# EAGLE design SparkFun_Pi_Wedge_40-Pin_PreAssembled (EAGLE 7.3.0)
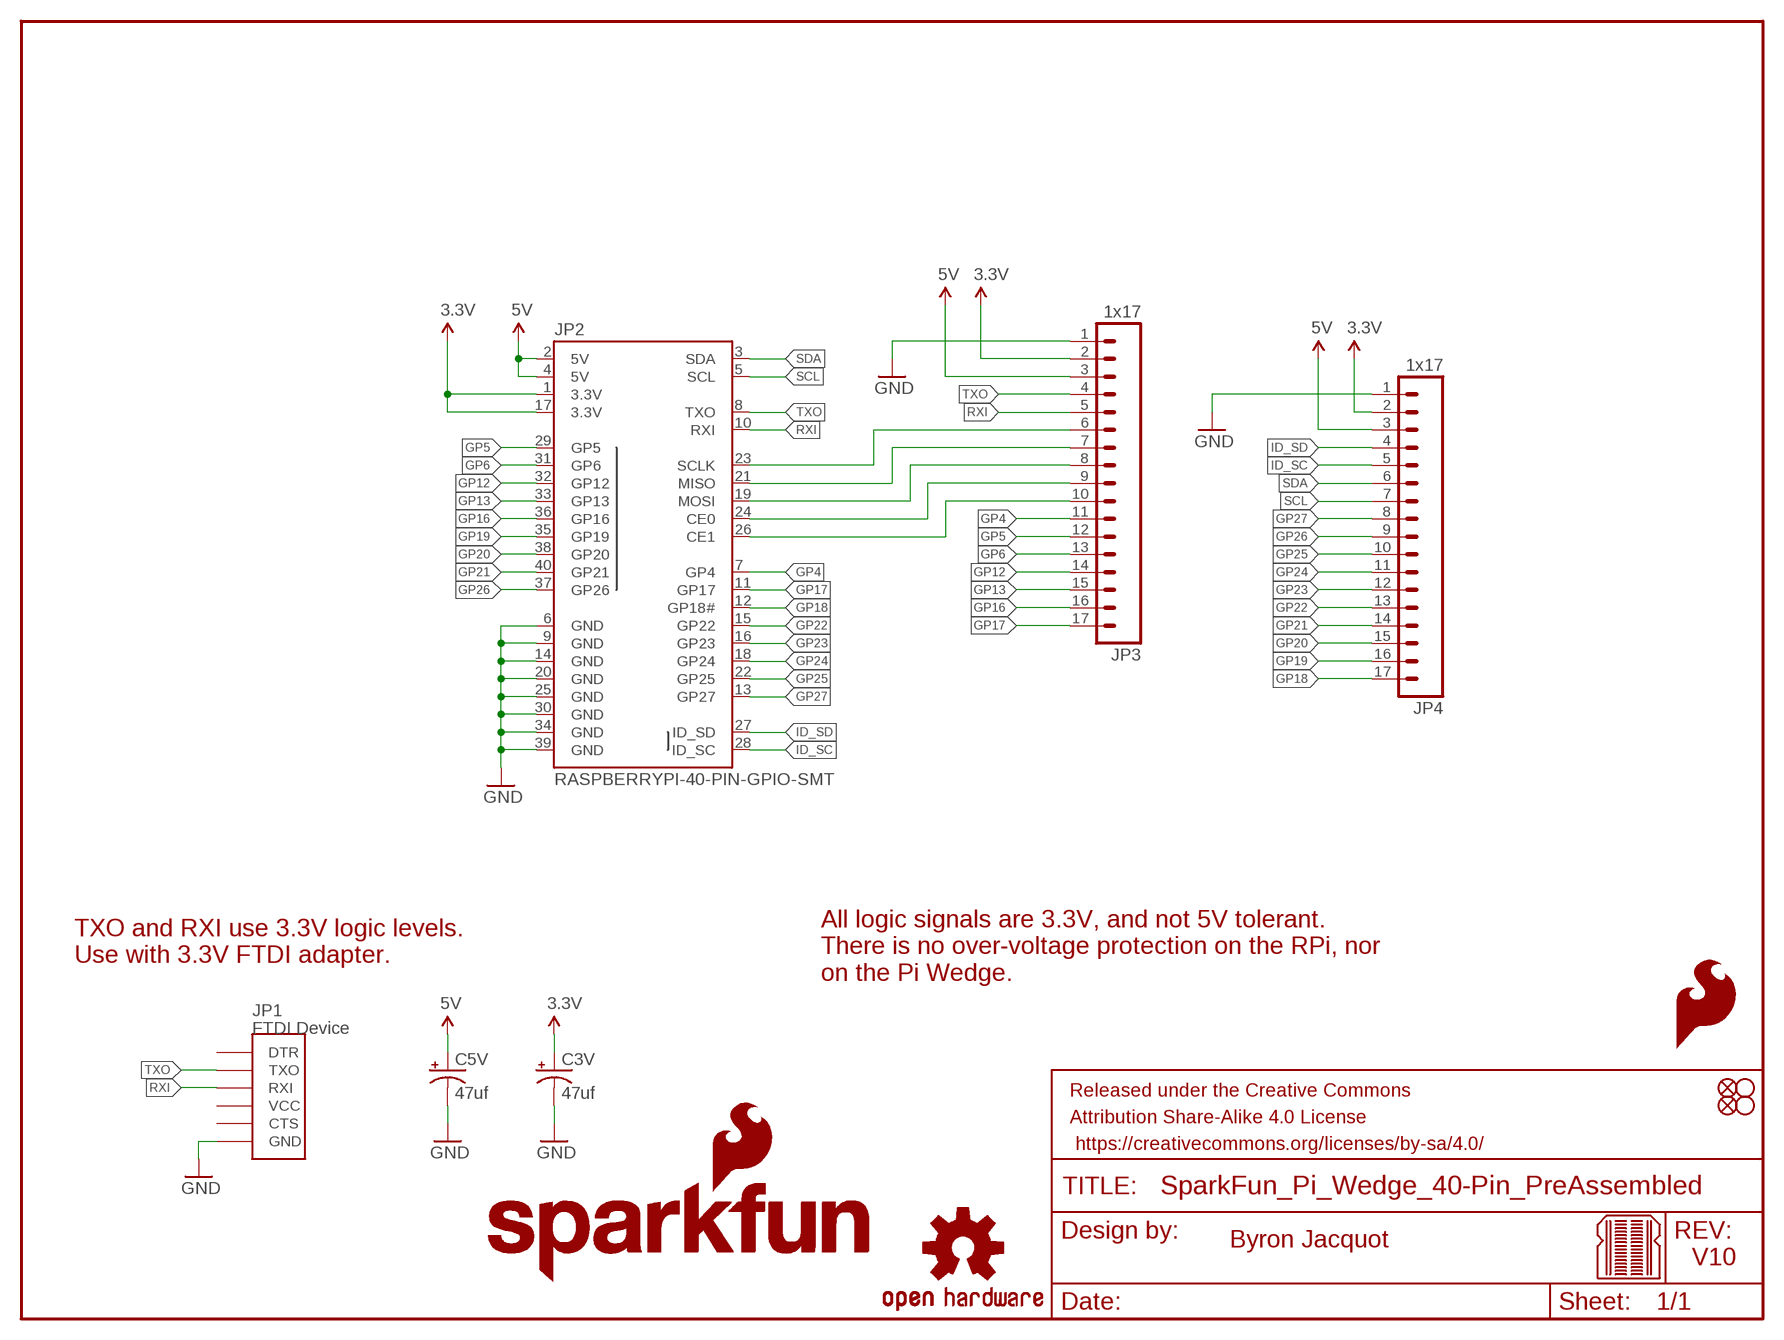
[diagram p0: schematic, sheet 1]

## Parts
C3V  47uf  47UF-50V-20%(ELECT)  [PANASONIC_D]
C5V  47uf  47UF-50V-20%(ELECT)  [PANASONIC_D]
FID1  FIDUCIALUFIDUCIAL  [MICRO-FIDUCIAL]
FID2  FIDUCIALUFIDUCIAL  [MICRO-FIDUCIAL]
FRAME2  FRAME-LETTER  [CREATIVE_COMMONS]
JP1  FTDI Device  FTDI_DEVICERA_SMT  [FTDI_DEVICE_RA_SMT]
JP2  RASPBERRYPI-40-PIN-GPIO-SMT  [2X20-SHROUDED-SMT]
JP3  1x17  M17KIT  [1X17_NO_SILK_KIT]
JP4  1x17  M17KIT  [1X17_NO_SILK_KIT]
LOGO1  SFE_LOGO_NAME.2_INCH  [SFE_LOGO_NAME_.2]
LOGO2  SFE_LOGO_NAME_FLAME.2_INCH  [SFE_LOGO_NAME_FLAME_.2]
LOGO3  SFE_LOGO_FLAME.1_INCH  [SFE_LOGO_FLAME_.1]
LOGO4  SFE_LOGO_FLAME.1_INCH  [SFE_LOGO_FLAME_.1]
LOGO5  OSHW-LOGOS  [OSHW-LOGO-S]
STANDOFF1  STAND-OFF  [STAND-OFF]
STANDOFF2  STAND-OFF  [STAND-OFF]
U$2  BREADBOARD_PATTERN  [BREADBOARD_SPACING]

## Nets
3.3V: C3V.+ JP2.1(3.3V) JP2.17(3.3V) JP3.2 JP4.2
5V: C5V.+ JP2.2(5V) JP2.4(5V) JP3.3 JP4.3
CE0: JP2.24(CE0) JP3.9
CE1: JP2.26(CE1) JP3.10
GND: C3V.- C5V.- JP1.6(GND) JP2.6(GND) JP2.9(GND) JP2.14(GND) JP2.20(GND) JP2.25(GND) JP2.30(GND) JP2.34(GND) JP2.39(GND) JP3.1 JP4.1
GP4: JP2.7(GP4) JP3.11
GP5: JP2.29(GP5) JP3.12
GP6: JP2.31(GP6) JP3.13
GP12: JP2.32(GP12) JP3.14
GP13: JP2.33(GP13) JP3.15
GP16: JP2.36(GP16) JP3.16
GP17: JP2.11(GP17) JP3.17
GP18: JP2.12(GP18#) JP4.17
GP19: JP2.35(GP19) JP4.16
GP20: JP2.38(GP20) JP4.15
GP21: JP2.40(GP21) JP4.14
GP22: JP2.15(GP22) JP4.13
GP23: JP2.16(GP23) JP4.12
GP24: JP2.18(GP24) JP4.11
GP25: JP2.22(GP25) JP4.10
GP26: JP2.37(GP26) JP4.9
GP27: JP2.13(GP27) JP4.8
ID_SC: JP2.28(ID_SC) JP4.5
ID_SD: JP2.27(ID_SD) JP4.4
MISO: JP2.21(MISO) JP3.7
MOSI: JP2.19(MOSI) JP3.8
RXI: JP1.3(RXI) JP2.10(RXI) JP3.5
SCL: JP2.5(SCL) JP4.7
SCLK: JP2.23(SCLK) JP3.6
SDA: JP2.3(SDA) JP4.6
TXO: JP1.2(TXO) JP2.8(TXO) JP3.4
Unconnected: JP1.1(DTR) JP1.4(VCC) JP1.5(CTS)

## Notes on the sheet
- TXO and RXI use 3.3V logic levels.
  Use with 3.3V FTDI adapter.
- All logic signals are 3.3V, and not 5V tolerant.
  There is no over-voltage protection on the RPi, nor
  on the Pi Wedge.
- Byron Jacquot
- V10

## Library data of the parts
C3V C5V = SparkFun-Capacitors:47UF-50V-20%(ELECT): CAP-10547; PROD_ID: CAP-10547
FID1 FID2 = SparkFun-Aesthetics:FIDUCIAL: Fiducial Alignment Points Various fiducial points for machine vision alignment.
FRAME2 = SparkFun-Aesthetics:FRAME-LETTER: Schematic Frame Standard 8.5x11 US Letter frame
JP1 = SparkFun-Connectors:FTDI_DEVICE: Connector which mates to FTDI basic or FTDI cable.; PROD_ID: CONN-08971
JP2 = SparkFun-Boards:RASPBERRYPI-40-PIN-GPIO: Second Generation Raspberry Pi GPIO Header 2x20 pin connector, as found on B, B+, A+ models.; PROD_ID: CONN-13143
JP3 JP4 = SparkFun-Connectors:M17: 1x17 .1" header; PROD_ID: CONN-12294
LOGO1 = SparkFun-Aesthetics:SFE_LOGO_NAME: SFE Logo, name only This is the SparkFun name logo. The logo on the schematic will always be the same size; the package variant is the height of the flame part of the logo (or the height the flame would be, if it were drawn). Default layer for the logo on the board is tSilk.
LOGO2 = SparkFun-Aesthetics:SFE_LOGO_NAME_FLAME: SFE Logo, name and flame This is the SparkFun full logo. The logo on the schematic will always be the same size; the package variant is the height of the flame part of the logo. Default layer for the logo on the board is tSilk.
LOGO3 LOGO4 = SparkFun-Aesthetics:SFE_LOGO_FLAME: SFE Logo, flame only This is the SparkFun flame logo. The logo on the schematic will always be the same size; the package variant is the height of the flame. Default layer for the logo on the board is tSilk.
LOGO5 = SparkFun-Aesthetics:OSHW-LOGO: Open Source Hardware Logo This logo indicates the piece of hardware it is found on incorporates a OSHW license and/or adheres to the definition of open source hardware found here: http://freedomdefined.org/OSHW
STANDOFF1 STANDOFF2 = SparkFun-Electromechanical:STAND-OFF: #4 Stand Off This is the mechanical footprint for a #4 phillips button head screw. Use the keepout ring to avoid running the screw head into surrounding components. SKU : PRT-00447
U$2 = SparkFun-Aesthetics:BREADBOARD_PATTERN: Reference markings that correspond to solderless breadboard row spacing.

## Board
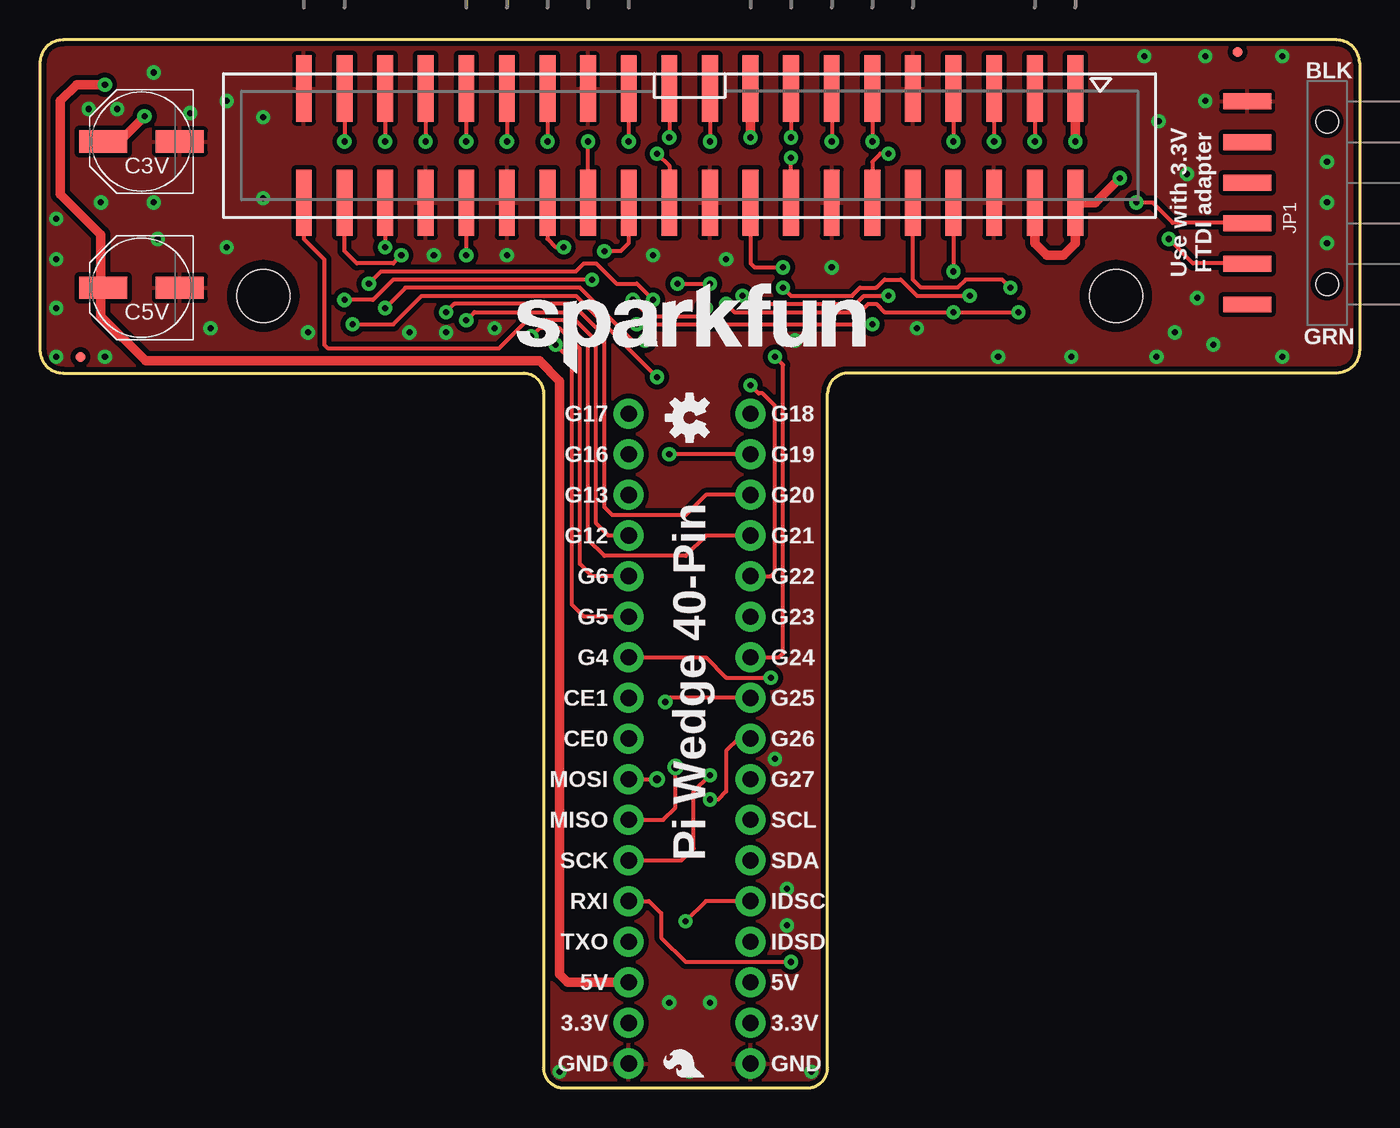
[diagram p1: board, top side]
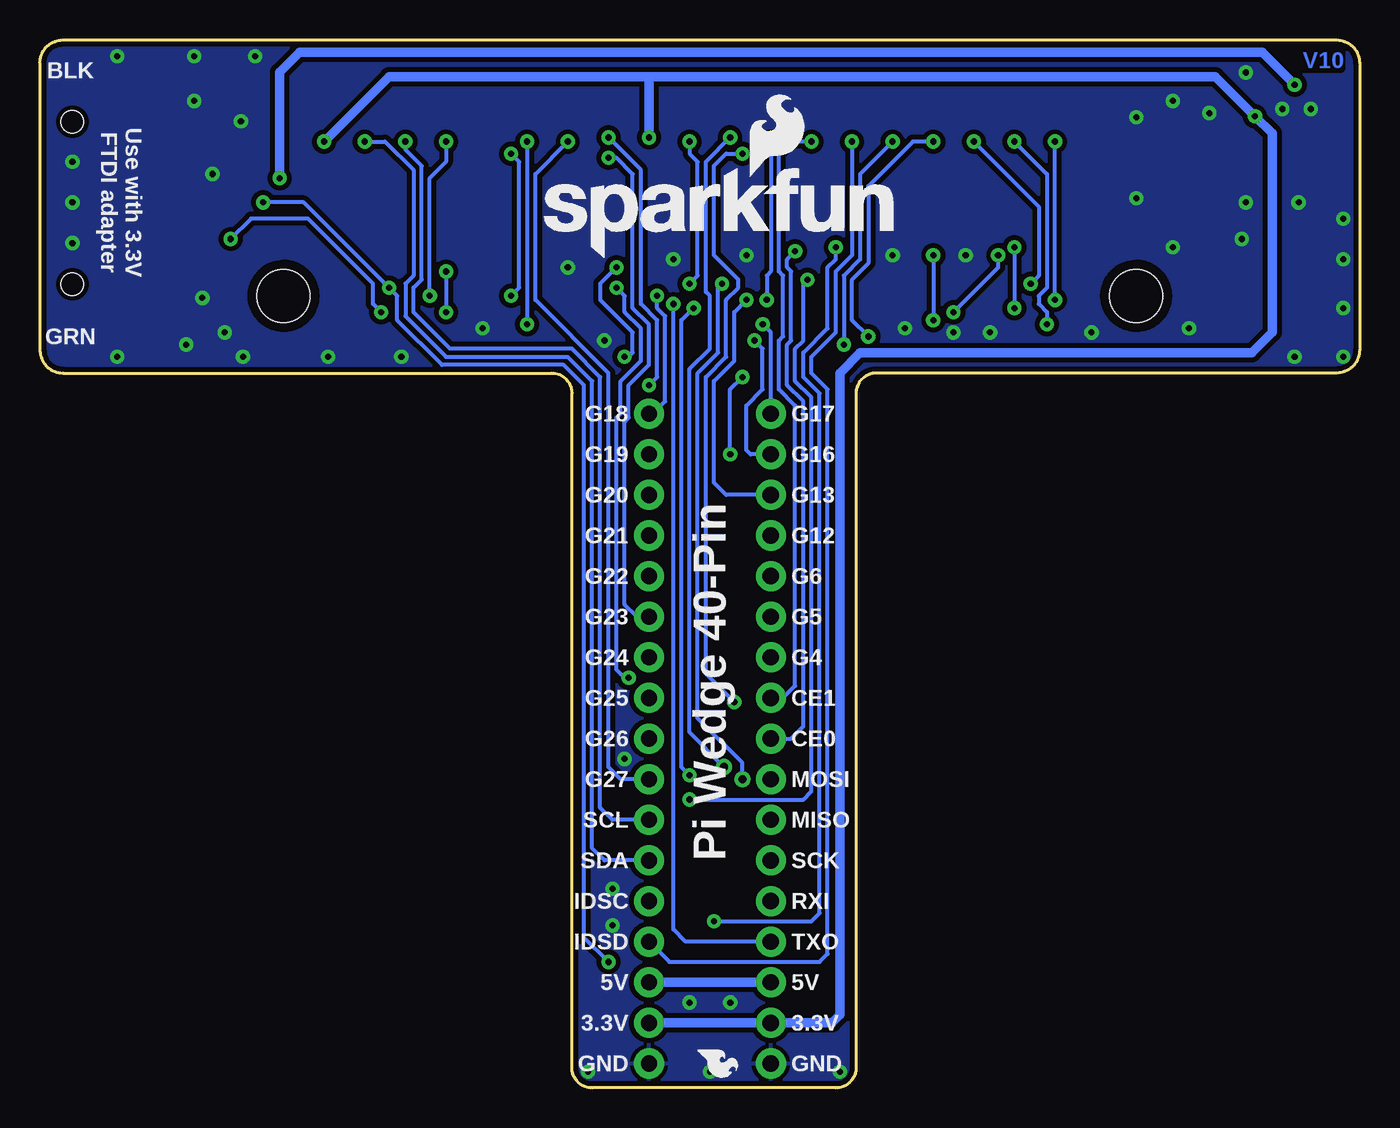
[diagram p2: board, bottom side, seen from below]

Size 82.55 x 65.53 mm. Coordinates in mm from the lower left corner, seen from the top.
Outline: 82.55,64.09 82.55,46.14 arc-90 81.11,44.7 50.55,44.7 arc90 49.28,43.43 49.28,1.27 arc-90 48.01,0 32.77,0 arc-90 31.5,1.27 31.5,43.43 arc90 30.23,44.7 1.44,44.7 arc-90 0,46.14 0,64.09 arc-90 1.44,65.53 81.11,65.53 arc-90 82.55,64.09
Copper layers (1*16): Top 0.035mm / dielectric 1.5mm / Bottom 0.035mm
Design rules "SparkFun-2-layer": minimum track width 7mil, minimum drill 15mil, track to track 8mil, track to pad 8mil, pad to pad 8mil, via to via 8mil, smd to smd 8mil, copper to edge 8mil, drill to drill 8mil, minimum pad ring 12mil, minimum via ring 10mil, stop-mask expansion 4mil, vias tented up to drill 20mil, thermal gap 10mil

### Footprints (pad centres in the part's own frame; a part is rotated, then mirrored left to right if it is on the bottom)
PANASONIC_D = smd 3 x 1.4: + 2.4,0; - -2.4,0
MICRO-FIDUCIAL = smd 0.635 x 0.635: 1 0,0
FTDI_DEVICE_RA_SMT = smd 1 x 3: 1 -6.35,5; 2 -3.81,5; 3 -1.27,5; 4 1.27,5; 5 3.81,5; 6 6.35,5 | hole 1.4: -5.08,0; 5.08,0
2X20-SHROUDED-SMT = smd 4.14 x 0.991: 1 -3.569,24.13; 2 3.569,24.13; 3 -3.569,21.59; 4 3.569,21.59; 5 -3.569,19.05; 6 3.569,19.05; 7 -3.569,16.51; 8 3.569,16.51; 9 -3.569,13.97; 10 3.569,13.97; 11 -3.569,11.43; 12 3.569,11.43; 13 -3.569,8.89; 14 3.569,8.89; 15 -3.569,6.35; 16 3.569,6.35; 17 -3.569,3.81; 18 3.569,3.81; 19 -3.569,1.27; 20 3.569,1.27; 21 -3.569,-1.27; 22 3.569,-1.27; 23 -3.569,-3.81; 24 3.569,-3.81; 25 -3.569,-6.35; 26 3.569,-6.35; 27 -3.569,-8.89; 28 3.569,-8.89; 29 -3.569,-11.43; 30 3.569,-11.43; 31 -3.569,-13.97; 32 3.569,-13.97; 33 -3.569,-16.51; 34 3.569,-16.51; 35 -3.569,-19.05; 36 3.569,-19.05; 37 -3.569,-21.59; 38 3.569,-21.59; 39 -3.569,-24.13; 40 3.569,-24.13
1X17_NO_SILK_KIT = drill 1.016 pad 1.88: 1 0,0; 2 2.54,0; 3 5.08,0; 4 7.62,0; 5 10.16,0; 6 12.7,0; 7 15.24,0; 8 17.78,0; 9 20.32,0; 10 22.86,0; 11 25.4,0; 12 27.94,0; 13 30.48,0; 14 33.02,0; 15 35.56,0; 16 38.1,0; 17 40.64,0
STAND-OFF = hole 3.302: 0,0

### Placement (x,y rotation side)
C3V  6.35,59.18 180 top
C5V  6.35,50.04 180 top
FID1  74.93,64.77 0 top
FID2  2.54,45.72 0 top
FRAME2  19.56,-17.78 0 top  (outside the outline)
JP1  80.52,55.34 90 top
JP2  40.64,58.93 270 top
JP3  36.83,1.52 90 bottom
JP4  44.45,1.52 90 bottom
LOGO1  29.84,44.7 0 top
LOGO2  51.69,51.82 0 bottom
LOGO3  41.91,0.38 90 top
LOGO4  41.78,2.67 270 bottom
LOGO5  40.64,41.91 90 top
STANDOFF1  13.97,49.53 0 top
STANDOFF2  67.31,49.53 0 top
U$2  40.64,68.83 0 top  (outside the outline)

### Tracks (layer width: path | path; a pad name or v marks a point on that pad's centre or on a via)
3.3V  (via drill 0.38)
  Top 0.61: v64.77,59.18 JP2.1 | JP2.17 v44.45,59.44 | C3V.+ 4.95,59.18 v6.54,60.77 6.48,60.71
  Bottom 0.61: JP4.2 JP3.2 33.02,4.06 32.51,4.57 32.51,44.7 31.24,45.97 6.73,45.97 5.46,47.24 5.46,59.69 v6.54,60.77 9.02,63.25 44.45,63.25 | 44.45,63.25 60.71,63.25 v64.77,59.18 | v44.45,59.44 44.45,63.25
5V  (via drill 0.38)
  Top 0.254: 4.2,49.92 3.81,49.53
  Top 0.61: JP3.3 33.02,6.6 32.51,7.11 32.51,44.2 31.24,45.47 6.6,45.47 3.81,48.26 3.81,49.53 3.81,50.04 | 3.81,50.04 3.81,53.34 1.27,55.88 1.27,61.72 2.29,62.74 v4.06,62.74 | 3.81,50.04 C5V.+ | JP2.4 62.23,52.83 62.99,52.07 64.01,52.07 64.77,52.83 JP2.2 66.03,55.36 v67.56,56.9
  Bottom 0.61: JP3.3 JP4.3 | v4.06,62.74 6.1,64.77 66.29,64.77 67.56,63.5 v67.56,56.9
CE0  (via drill 0.38)
  Top 0.254: JP2.24 36.83,52.83 36.32,52.32 v35.31,52.32
  Bottom 0.254: JP3.9 35.56,21.84 34.8,22.61 34.8,42.93 35.81,43.94 35.81,46.48 35.56,46.74 35.56,51.05 35.81,51.31 35.81,51.82 v35.31,52.32
CE1  (via drill 0.38)
  Top 0.254: JP2.26 v34.29,59.18
  Bottom 0.254: JP3.10 36.07,24.38 35.31,25.15 35.31,42.67 36.32,43.69 36.32,46.74 36.07,46.99 36.07,50.8 36.32,51.05 36.32,58.42 35.56,59.18 v34.29,59.18
GND  (via drill 0.38)
  other vias: 39.37,5.33 41.91,5.33 72.9,61.72 72.39,49.4 73.41,46.48 64.52,45.72 4.83,61.21 3.05,61.21 7.11,55.37 4.06,45.72 1.02,54.36 9.4,60.96 45.97,20.57 70.99,47.24 7.37,53.09 13.97,60.71 13.97,55.63 23.11,47.24 16.76,47.24 1.02,45.72 1.02,48.77 1.02,51.82 7.11,63.5 3.81,55.37 11.68,61.72 11.68,52.58 10.67,47.5 59.94,45.72 69.85,45.72 77.72,45.72 77.72,64.52 72.9,64.52 69.09,64.52 28.45,47.5 25.4,47.24 71.75,57.15 69.98,60.45 46.74,10.16 46.74,12.45 48.26,1.02 32.51,1.02 40.64,1.02 54.86,47.5 49.53,51.31 47.24,46.74 42.93,51.82 38.35,52.07 29.21,52.07 24.64,52.07 80.52,52.83 80.52,55.37 80.52,57.91
  pour Bottom (isolate 0.305): 1.27,44.7 30.23,44.7 arc-90 31.5,43.43 31.5,1.27 arc90 32.77,0 48.01,0 arc90 49.28,1.27 49.28,43.43 arc-90 50.55,44.7 81.28,44.7 arc90 82.55,45.97 82.55,65.53 0,65.53 0,46.1 arc90
  pour Top (isolate 0.305): 49.28,43.43 49.28,1.27 arc-90 48.01,0 32.77,0 arc-90 31.5,1.27 31.5,43.43 arc90 30.23,44.7 1.27,44.7 arc-90 0,46.1 0,65.53 82.55,65.53 82.55,45.97 arc-90 81.28,44.7 50.55,44.7 arc90
GP4  (via drill 0.38)
  Top 0.254: JP3.11 41.66,26.92 42.93,25.65 v45.72,25.65 | v46.48,50.04 46.99,49.53 50.8,49.53 51.31,50.04 52.32,50.04 52.83,50.55 53.85,50.55 54.86,49.53 v58.17,49.53 | JP2.7 v57.15,59.18
  Bottom 0.254: v45.72,25.65 45.97,25.65 46.48,26.16 46.48,41.91 46.23,42.16 46.23,44.2 44.96,45.47 44.96,47.5 45.97,48.51 45.97,49.53 v46.48,50.04 | v58.17,49.53 58.17,56.9 57.15,57.91 v57.15,59.18
GP5  (via drill 0.38)
  Top 0.254: JP3.12 34.04,29.46 33.27,30.23 33.27,45.47 v32.26,46.48 | JP2.29 v29.21,59.18
  Bottom 0.254: v29.21,59.18 31.24,57.15 31.24,51.82 32.26,50.8 v32.26,46.48
GP6  (via drill 0.38)
  Top 0.254: JP3.13 34.54,32 33.78,32.77 33.78,46.23 32.51,47.5 31.24,47.5 v30.73,46.99 | JP2.31 v26.67,59.18
  Bottom 0.254: v26.67,59.18 27.94,59.18 30.73,56.39 30.73,51.56 31.75,50.55 31.75,48.01 v30.73,46.99
GP12  (via drill 0.38)
  Top 0.254: JP3.14 35.56,34.54 34.8,35.31 34.8,46.74 33.02,48.51 27.18,48.51 v26.67,48.01 | JP2.32 v26.67,52.07
  Bottom 0.254: v26.67,52.07 v26.67,48.01
GP13  (via drill 0.38)
  Top 0.254: JP2.33 v24.13,59.18 | v20.57,50.29 21.34,51.05 33.53,51.05 34.04,51.56 34.8,51.56 36.07,50.29 37.34,50.29 v38.35,49.28
  Bottom 0.254: JP3.15 39.62,37.08 40.39,37.85 40.39,44.2 39.12,45.47 39.12,48.51 v38.35,49.28 | v24.13,59.18 20.07,55.12 20.07,50.8 v20.57,50.29
GP16  (via drill 0.38)
  Top 0.254: v37.85,46.74 37.08,46.74 33.78,50.04 22.86,50.04 v21.59,48.77 | JP2.36 v21.59,52.58
  Bottom 0.254: JP3.16 38.1,39.62 38.35,39.88 38.35,42.67 37.34,43.69 37.34,46.23 v37.85,46.74 | v21.59,52.58 v21.59,48.77
GP17  (via drill 0.38)
  Top 0.254: JP2.11 v52.07,59.18 | v37.34,47.75 v52.07,47.75
  Bottom 0.254: JP3.17 36.83,47.24 v37.34,47.75 | v52.07,59.18 v52.07,47.75
GP18  (via drill 0.38)
  Top 0.254: v43.94,49.53 44.45,49.02 51.05,49.02 51.56,49.53 v53.09,49.53 | v53.09,58.42 52.58,58.42 52.07,57.91 JP2.12
  Bottom 0.254: JP4.17 44.2,42.16 43.43,42.93 43.43,48.26 43.94,48.77 v43.94,49.53 | v53.09,49.53 52.58,50.04 52.58,57.91 v53.09,58.42
GP19  (via drill 0.38)
  Top 0.254: JP4.16 v39.37,39.62 | JP2.35 v21.59,59.18 | v19.56,47.75 22.1,47.75 23.88,49.53 33.53,49.53 v38.61,44.45
  Bottom 0.254: v21.59,59.18 19.56,57.15 19.56,50.04 20.07,49.53 20.07,49.02 19.56,48.51 v19.56,47.75 | v38.61,44.45 39.37,43.69 v39.37,39.62
GP20  (via drill 0.38)
  Top 0.254: JP4.15 41.66,37.08 40.39,35.81 35.81,35.81 35.31,36.32 35.31,46.99 33.27,49.02 25.91,49.02 v25.4,48.51 | JP2.38 19.05,52.32 19.81,51.56 22.1,51.56 v22.61,52.07
  Bottom 0.254: v25.4,48.51 22.61,51.31 v22.61,52.07
GP21
  Top 0.254: JP4.14 41.66,34.54 40.39,33.27 35.31,33.27 34.29,34.29 34.29,46.48 32.77,48.01 30.48,48.01 28.7,46.23 18.03,46.23 17.78,46.48 17.78,51.82 16.51,53.09 JP2.40
GP22  (via drill 0.38)
  Top 0.254: JP4.13 45.72,32 45.97,32.26 45.97,42.67 45.21,43.43 44.96,43.43 v44.45,43.94 | JP2.15 v46.99,59.44
  Bottom 0.254: v44.45,43.94 43.94,44.45 43.94,48.01 44.96,49.02 44.96,57.4 v46.99,59.44
GP23  (via drill 0.38)
  Top 0.254: JP2.16 v46.99,58.17
  Bottom 0.254: JP4.12 45.21,29.46 45.97,30.23 45.97,41.66 45.72,41.91 45.72,43.94 44.45,45.21 44.45,47.75 45.47,48.77 45.47,57.15 46.48,58.17 v46.99,58.17
GP24  (via drill 0.38)
  Top 0.254: JP4.11 46.23,26.92 46.48,27.18 46.48,45.21 v45.97,45.72 | JP2.18 44.45,51.56 44.7,51.31 v46.48,51.31
  Bottom 0.254: v45.97,45.72 45.72,45.72 45.47,45.97 45.47,47.24 47.5,49.28 47.5,50.29 v46.48,51.31
GP25  (via drill 0.38)
  Top 0.254: JP4.10 39.37,24.38 v39.12,24.13 | v38.61,58.42 39.37,57.66 JP2.22
  Bottom 0.254: v39.12,24.13 40.89,25.91 40.89,44.45 39.62,45.72 39.62,49.28 38.86,50.04 38.86,50.55 40.39,52.07 40.39,57.66 39.62,58.42 v38.61,58.42
GP26  (via drill 0.38)
  Top 0.254: JP4.9 43.69,21.84 42.93,21.08 42.93,18.54 42.42,18.03 v41.91,18.03 | v34.54,50.55 22.1,50.55 20.83,49.28 v19.05,49.28 | JP2.37 v19.05,59.18
  Bottom 0.254: v41.91,18.03 34.8,18.03 34.29,18.54 34.29,43.18 35.31,44.2 35.31,46.23 34.8,46.74 34.8,50.29 v34.54,50.55 | v19.05,49.28 v19.05,59.18
GP27  (via drill 0.38)
  Top 0.254: JP2.13 v49.53,59.18
  Bottom 0.254: JP4.8 46.23,19.3 46.99,20.07 46.99,44.7 51.56,49.28 51.56,57.15 v49.53,59.18
ID_SC  (via drill 0.38)
  Top 0.254: JP4.5 41.66,11.68 v40.39,10.41 | JP2.28 31.75,53.09 32.26,52.58 v32.77,52.58
  Bottom 0.254: v40.39,10.41 34.29,10.41 33.78,10.92 33.78,43.43 34.8,44.45 34.8,45.97 33.27,47.5 33.27,51.31 32.77,51.82 v32.77,52.58
ID_SD  (via drill 0.38)
  Top 0.254: JP2.27 v31.75,59.18
  Bottom 0.254: JP4.4 43.18,7.87 33.78,7.87 33.27,8.38 33.27,43.69 34.29,44.7 34.29,45.72 32.77,47.24 32.77,51.05 31.75,52.07 v31.75,59.18
MISO  (via drill 0.38, 0.51)
  Top 0.254: JP3.7 38.99,16.76 39.75,17.53 v39.75,20.07 | JP2.21 v39.37,59.44
  Bottom 0.254: v39.75,20.07 41.91,22.23 41.91,44.96 40.64,46.23 40.64,49.53 40.89,49.78 40.89,57.91 v39.37,59.44
MOSI  (via drill 0.38, 0.51)
  Top 0.254: JP3.8 v38.61,19.3 | v39.88,50.29 v41.91,50.29 | JP2.19 v41.91,59.18
  Bottom 0.254: v38.61,19.3 38.61,20.32 41.4,23.11 41.4,44.7 40.13,45.97 40.13,50.04 v39.88,50.29 | v41.91,50.29 41.4,50.8 41.4,57.91 41.91,58.42 v41.91,59.18
RXI  (via drill 0.38)
  Top 0.254: JP3.5 38.1,11.68 38.86,10.92 38.86,9.4 40.39,7.87 v46.99,7.87 | v60.71,50.04 60.2,50.55 57.91,50.55 57.4,50.04 55.12,50.04 54.61,50.55 JP2.10 | v68.58,55.37 69.6,55.37 70.87,54.1 75.49,54.1 JP1.3
  Bottom 0.254: v46.99,7.87 48.51,9.4 48.51,43.94 49.78,45.21 57.4,45.21 60.2,48.01 60.2,49.53 v60.71,50.04 66.04,55.37 v68.58,55.37
SCL  (via drill 0.38)
  Top 0.254: JP2.5 v59.69,59.18
  Bottom 0.254: JP4.7 46.74,16.76 47.5,17.53 47.5,44.45 49.28,46.23 56.9,46.23 59.18,48.51 59.18,50.04 58.67,50.55 58.67,57.66 59.69,58.67 v59.69,59.18
SCLK  (via drill 0.38)
  Top 0.254: JP3.6 40.13,14.22 40.89,14.99 40.89,18.54 v41.91,19.56 | JP2.23 v36.83,59.18 | v37.08,49.28 38.1,48.26 41.15,48.26 v41.66,48.77
  Bottom 0.254: v41.91,19.56 42.42,20.07 42.42,48.01 v41.66,48.77 | v36.83,59.18 36.83,51.05 37.08,50.8 v37.08,49.28
SDA  (via drill 0.38)
  Top 0.254: JP2.3 v62.23,59.18
  Bottom 0.254: JP4.6 47.24,14.22 48.01,14.99 48.01,44.2 49.53,45.72 57.15,45.72 59.69,48.26 59.69,50.29 59.18,50.8 59.18,57.4 60.96,59.18 v62.23,59.18
TXO  (via drill 0.38)
  Top 0.254: v42.93,49.02 43.43,48.51 51.31,48.51 51.82,49.02 52.32,49.02 52.83,48.51 v57.15,48.51 v61.21,48.51 | JP2.8 v57.15,51.05 | JP1.2 75.49,51.56 72.14,51.56 v70.61,53.09
  Bottom 0.254: JP3.4 42.16,9.14 42.93,9.91 v42.93,49.02 | v57.15,51.05 v57.15,48.51 | v70.61,53.09 69.34,54.36 65.79,54.36 61.72,50.29 61.72,49.02 v61.21,48.51

### Text on the board
Bottom: V10
tPlace: BLK | Use with 3.3V / FTDI adapter | GRN | G17 | G18 | G16 | G19 | G13 | G20 | G12 | G21 | G6 | G22 | G5 | G23 | G4 | G24 | Pi Wedge 40-Pin | CE1 | G25 | CE0 | G26 | MOSI | G27 | MISO | SCL | SCK | SDA | RXI | IDSC | TXO | IDSD | 5V | 5V | 3.3V | 3.3V | GND | GND
bPlace: BLK | Use with 3.3V / FTDI adapter | GRN | G17 | G18 | G16 | G19 | G13 | G20 | G12 | G21 | G6 | G22 | G5 | G23 | G4 | G24 | Pi Wedge 40-Pin | CE1 | G25 | CE0 | G26 | MOSI | G27 | MISO | SCL | SCK | SDA | RXI | IDSC | TXO | IDSD | 5V | 5V | 3.3V | 3.3V | GND | GND
Measures: 2x 0.13" holes / Clear 4-40 screws | All Units In Inches
tDocu: Byron Jacquot